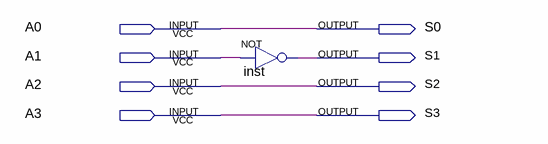
[diagram p0: schematic sheet]
// Quartus schematic hw8p2.bdf as structural Verilog: 1 symbols, 8 pins
module hw8p2 (
  input  A0,
  input  A1,
  input  A2,
  input  A3,
  output S0,
  output S1,
  output S2,
  output S3
);

  not inst (S1, A1);

  assign S0 = A0;
  assign S2 = A2;
  assign S3 = A3;
endmodule
